# EAGLE schematic s1 (EAGLE 7.5.0)
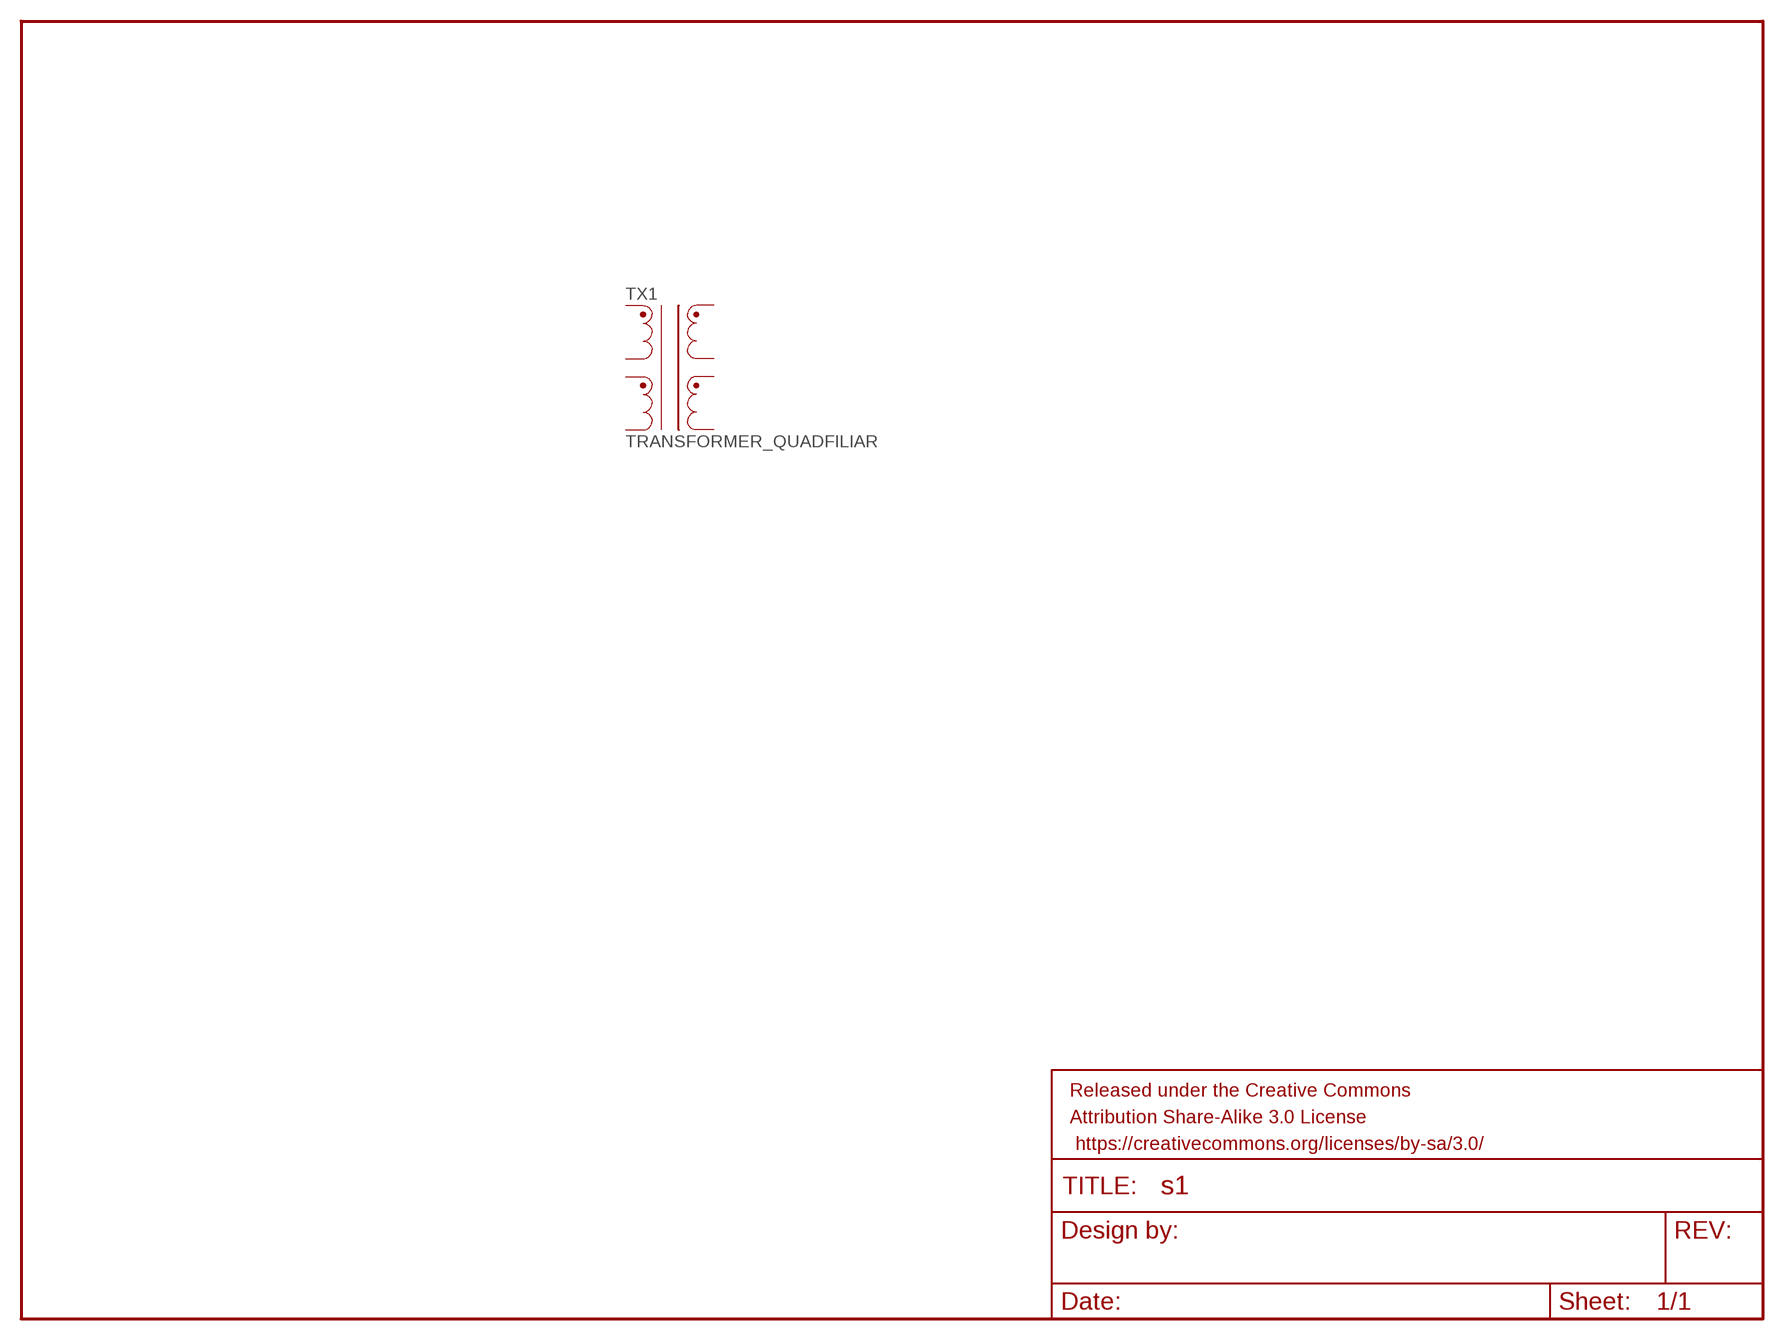
[diagram p0: schematic, sheet 1]

## Parts
FRAME2  FRAME-LETTER  [CREATIVE_COMMONS]
TX1  TRANSFORMER_QUADFILIAR  [COILCRAFT_DA230X]
Unconnected: TX1.P$1 TX1.P$2 TX1.P$3 TX1.P$4 TX1.P$5 TX1.P$6 TX1.P$7 TX1.P$8

## Library data of the parts
FRAME2 = SparkFun-Retired:FRAME-LETTER: Schematic Frame Standard 8.5x11 US Letter frame
TX1 = SparkFun-PowerIC:TRANSFORMER_QUADFILIAR: Transformer with 4 independent windings